# Altium project USB_ISO_FS_00.PrjPcb
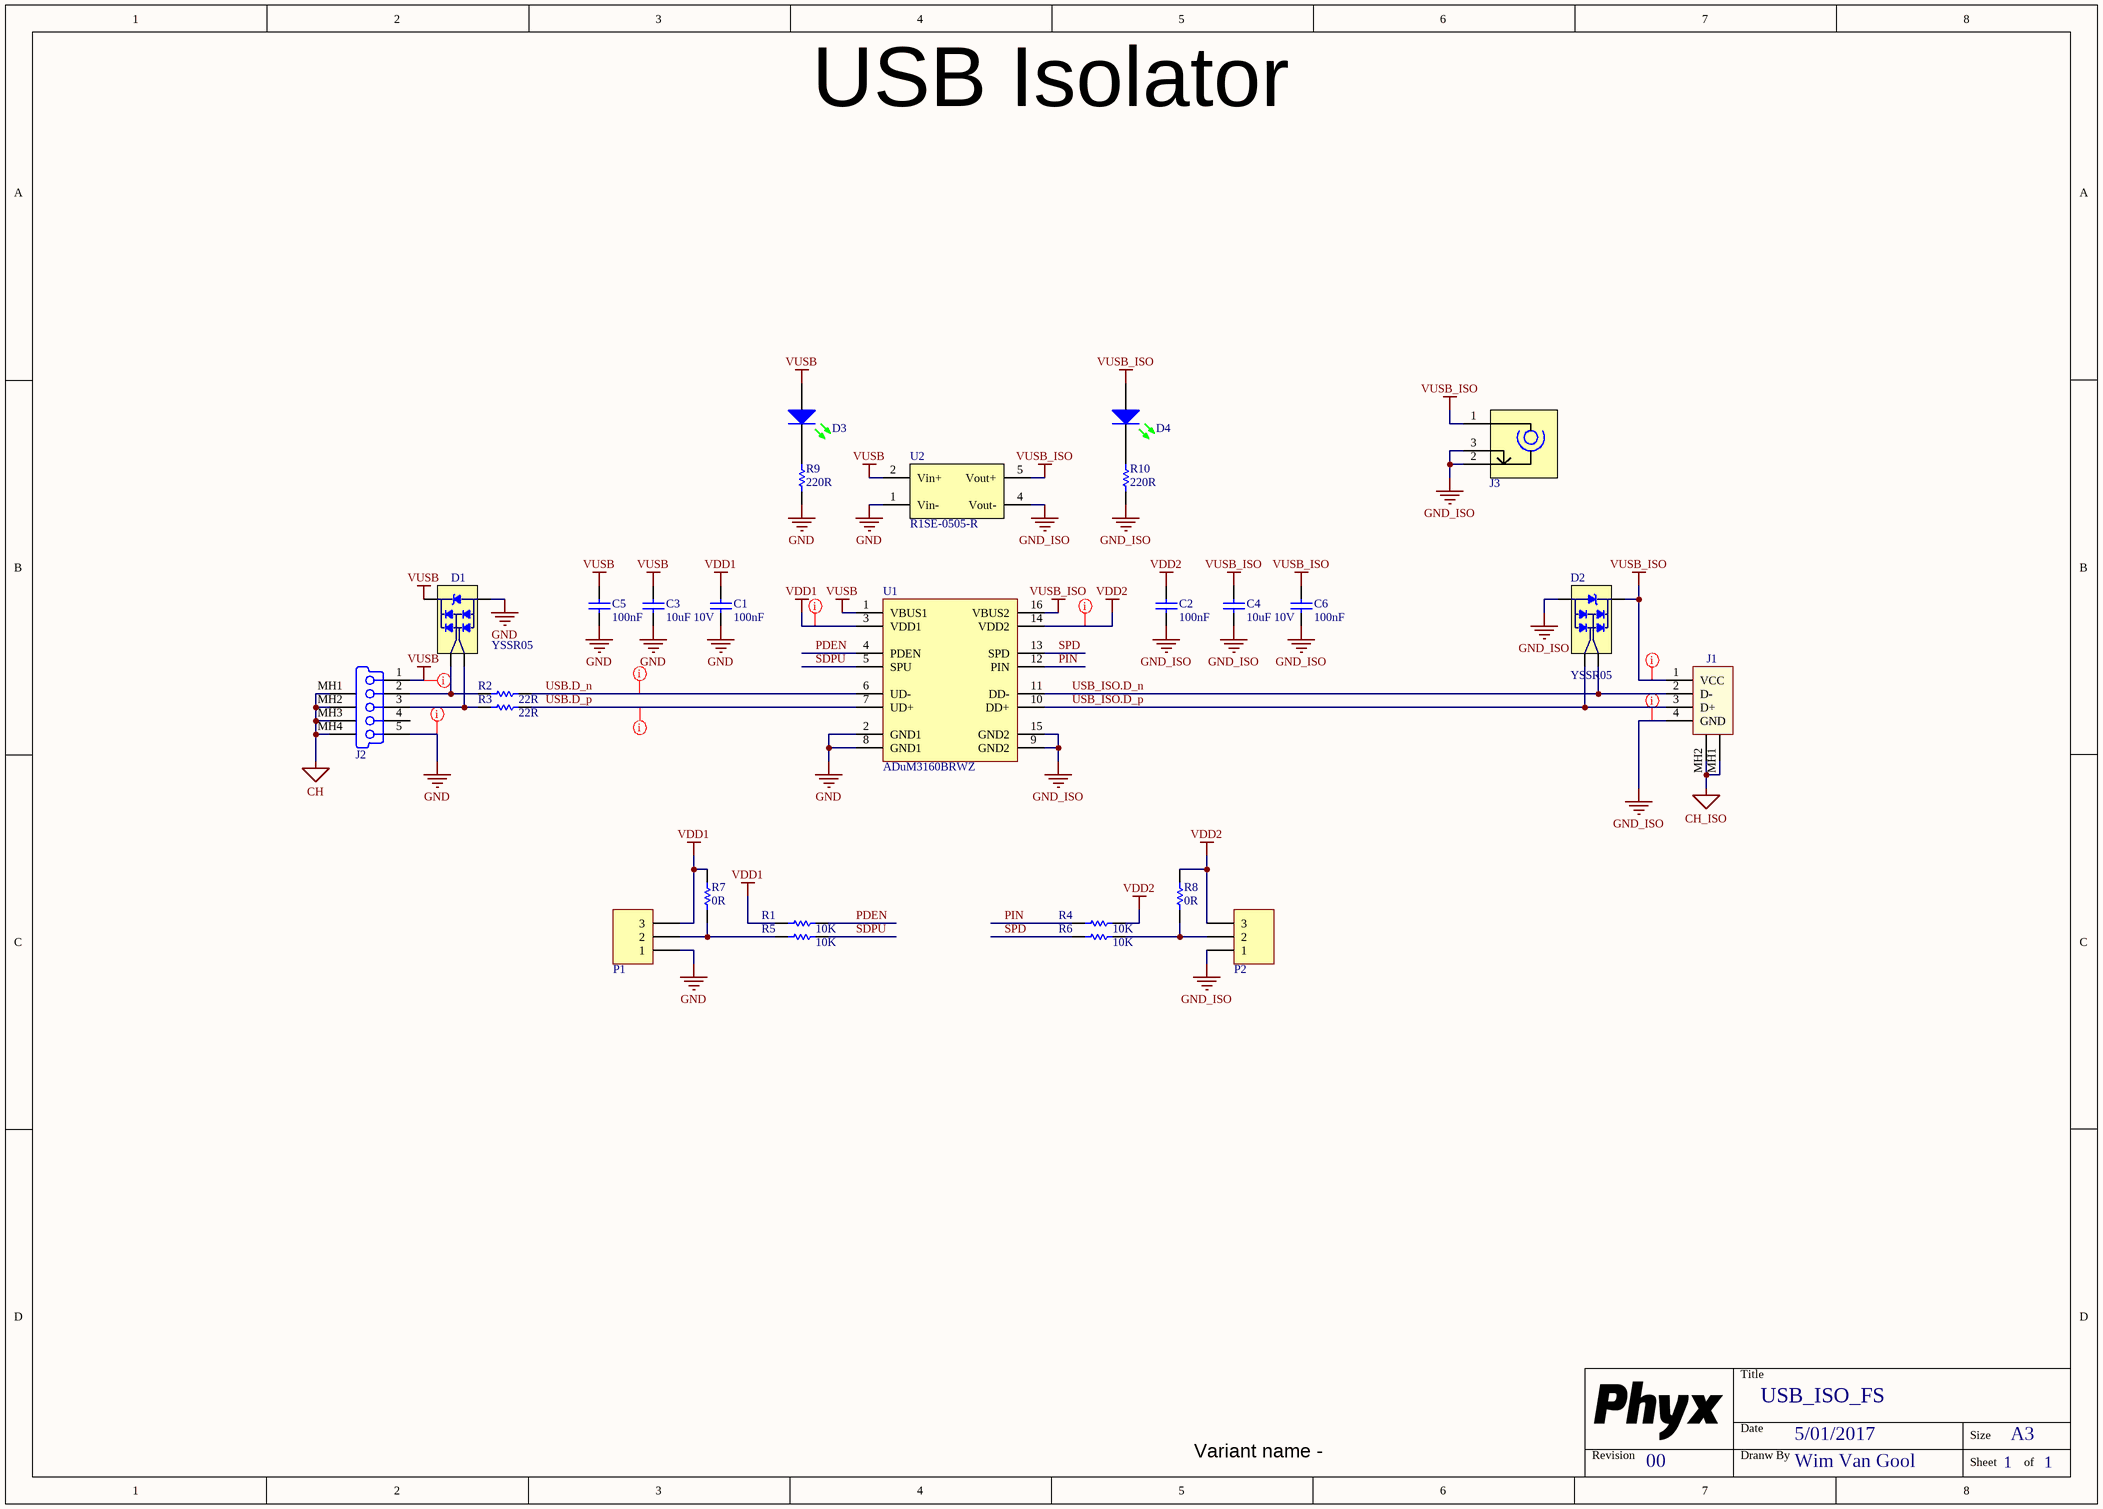
[diagram p0: USB_ISO_FS_00.SchDoc]
PCB_TITLE: USB_ISO_FS; PCB_REV: 00; PCB_ENGINEER: WimVG
1 sheet, 27 parts. Net scope: global (net labels, ports and power ports of the same name join across sheets).
Board file: USB_ISO_FS_00.PcbDoc

## Sheet USB_ISO_FS_00.SchDoc: USB_ISO_FS
size A3; Date: 5/01/2017; DrawnBy: Wim Van Gool; Revision: 00; SheetNumber: 1; SheetTotal: 1; PageSetup: Record=PageOptions|CenterHorizontal=True|CenterVertical=True|PrintScale=0.70|XCorrection=1.00|YCorrection=1.00|PrintKind=1|BorderSize=5000000|LeftOffset=0|BottomOffset=0|Orientation=2|PaperLength=1000|PaperWidth=1000|Scale=100|PaperSource=15|PrintQuality=600|MediaType=1|DitherType=10|PrintScaleMode=1|PaperKind=A4 (210 x 297 mm)|PaperIndex=9

### Parts
C1  value 100nF  [C0603_N]  (hidden comment: CAP_CERAMIC)
C2  value 100nF  [C0603_N]  (hidden comment: CAP_CERAMIC)
C3  value 10uF 10V  [C0805_N]  (hidden comment: CAP_CERAMIC)
C4  value 10uF 10V  [C0805_N]  (hidden comment: CAP_CERAMIC)
C5  value 100nF  [C0603_N]  (hidden comment: CAP_CERAMIC)
C6  value 100nF  [C0603_N]  (hidden comment: CAP_CERAMIC)
D1  value YSSR05  [SOT-143]  (hidden comment: Low Capacitanse TVS Diode array)
D2  value YSSR05  [SOT-143]  (hidden comment: Low Capacitanse TVS Diode array)
D3  Default 0805 Green LED  [LED_0805_GR]  (value not drawn)
D4  Default 0805 Green LED  [LED_0805_GR]  (value not drawn)
J1  USB type A Short horizontal connector  [WE_614104150121]  (value not drawn)
J2  THT USB Mini-B Receptacle  [USB_Mini-B_THT]  (value not drawn)
J3  Socket RA 3.5 with 1.35 barrel  [DC-003]  (value not drawn)
P1  Header 3  [HDR1X3]  (value not drawn)
P2  Header 3  [HDR1X3]  (value not drawn)
R1  value 10K  [R0603_N]  (hidden comment: RESISTOR)
R2  value 22R  [R0603_N]  (hidden comment: RESISTOR)
R3  value 22R  [R0603_N]  (hidden comment: RESISTOR)
R4  value 10K  [R0603_N]  (hidden comment: RESISTOR)
R5  value 10K  [R0603_N]  (hidden comment: RESISTOR)
R6  value 10K  [R0603_N]  (hidden comment: RESISTOR)
R7  value 0R  [R0603_N]  (hidden comment: RESISTOR)
R8  value 0R  [R0603_N]  (hidden comment: RESISTOR)
R9  value 220R  [R0603_N]  (hidden comment: RESISTOR)
R10  value 220R  [R0603_N]  (hidden comment: RESISTOR)
U1  value ADuM3160BRWZ  [SOIC_W_16]  (hidden comment: USB FS 12Mbps isolator 2,5kV)
U2  value R1SE-0505-R  [R1SE-0505-R]  (hidden comment: Isolated DC-DC module 1kV 5V 1W)

### Nets
CH: J2.MH1(Tab) J2.MH2(Tab) J2.MH3(Tab) J2.MH4(Tab)
CH_ISO: J1.MH1(Tab) J1.MH2(Tab)
GND: C1.2 C3.2 C5.2 D1.1 J2.5(GND) P1.1 R9.2 U1.2(GND1) U1.8(GND1) U2.1(Vin-)
GND_ISO: C2.2 C4.2 C6.2 D2.1 J1.4(GND) J3.2 J3.3 P2.1 R10.2 U1.9(GND2) U1.15(GND2) U2.4(Vout-)
VDD1: C1.1 P1.3 R1.2 R7.1 U1.3(VDD1)
VDD2: C2.1 P2.3 R4.1 R8.1 U1.14(VDD2)
VUSB: C3.1 C5.1 D1.4 D3.1(A) J2.1(V_BUS_(5V)) U1.1(VBUS1) U2.2(Vin+)
VUSB_ISO: C4.1 C6.1 D2.4 D4.1(A) J1.1(VCC) J3.1 U1.16(VBUS2) U2.5(Vout+)
PDEN: R1.1 U1.4(PDEN)
PIN: R4.2 U1.12(PIN)
SDPU: R5.1 U1.5(SPU)
SPD: R6.2 U1.13(SPD)
USB.D_n: R2.1 U1.6(UD-)
USB.D_p: R3.1 U1.7(UD+)
USB_ISO.D_n: D2.3 J1.2(D-) U1.11(DD-)
USB_ISO.D_p: D2.2 J1.3(D+) U1.10(DD+)
NetD1_2: D1.2 J2.3(D+) R3.2
NetD1_3: D1.3 J2.2(D-) R2.2
NetD3_2: D3.2(K) R9.1
NetD4_2: D4.2(K) R10.1
NetP1_2: P1.2 R5.2 R7.2
NetP2_2: P2.2 R6.1 R8.2

Not connected (* = marked no-connect by the designer): J2 4(NC)

### Layout directives
net class POWER: GND, GND_ISO, VDD1, VDD2, VUSB, VUSB_ISO
net class 90r: USB.D_n, USB.D_p

### Notes on the sheet
- USB Isolator
- Title
- Variant name -
- Revision
- Date
- Dranw By
- Size
- A3
- Sheet
- of

### Library data of the parts
C1 C2 C5 C6 = CAP # 100nF 16V 0603: Capacitor Ceramic; Description: CAP # 100nF 16V 0603
C3 C4 = CAP # 10uF 10V 0805: Capacitor Ceramic; Description: CAP # 10uF 10V 0805; Supplier 1: Farnell; Supplier Part Number 1: 2320859
D1 D2 = TVS # YSSR05: =Description; Supplier 1: China
D3 D4 = LED # Green 0805: =Description; Description: LED # Green 0805; Supplier 1: Farnell; Supplier Part Number 1: 2099239
J1 = USB A 614104150121 Short: Description: USB A 614104150121 Short; Value: 614104150121
J2 = USB Mini-B F: Value: 651005136521; Description: USB Mini-B F; Supplier 1: Farnell; Supplier Part Number 1: 1841176
J3 = SCKT 1.35mm barrel 3.5mm dia: =Description; Value: DC-003; Description: SCKT 1.35mm barrel 3.5mm dia; Supplier 1: China
P1 P2 = Pin Header 2.54mm 3way: Description: Pin Header 2.54mm 3way
R1 R4-R6 = RES # 10K 0603: Description: RES # 10K 0603; Supplier 1: Farnell; Supplier Part Number 1: 2502397
R2 R3 = RES # 22R 0603: Description: RES # 22R 0603
R7 R8 = RES # 0R 0603: Description: RES # 0R 0603; Supplier 1: Farnell; Supplier Part Number 1: 2447743
R9 R10 = RES # 220R 0603: Description: RES # 220R 0603
U1 = ISO # USB ADuM3160BRWZ: =Description; Description: ISO # USB ADuM3160BRWZ; Supplier 1: Farnell; Supplier Part Number 1: 1843660
U2 = ISO # PWR 5V 1W 1kV R1SE-0505-R: =Description; Description: ISO # PWR 5V 1W 1kV R1SE-0505-R; Supplier 1: Farnell; Supplier Part Number 1: 2218601

## Assembly variants
INTERNAL POWER: not fitted J3 P1 P2
EXTERNAL POWER: not fitted P1 P2 U2